# Altium schematic sheet Clock_Generator.SchDoc
size A1; SheetNumber: 2; SheetTotal: 3
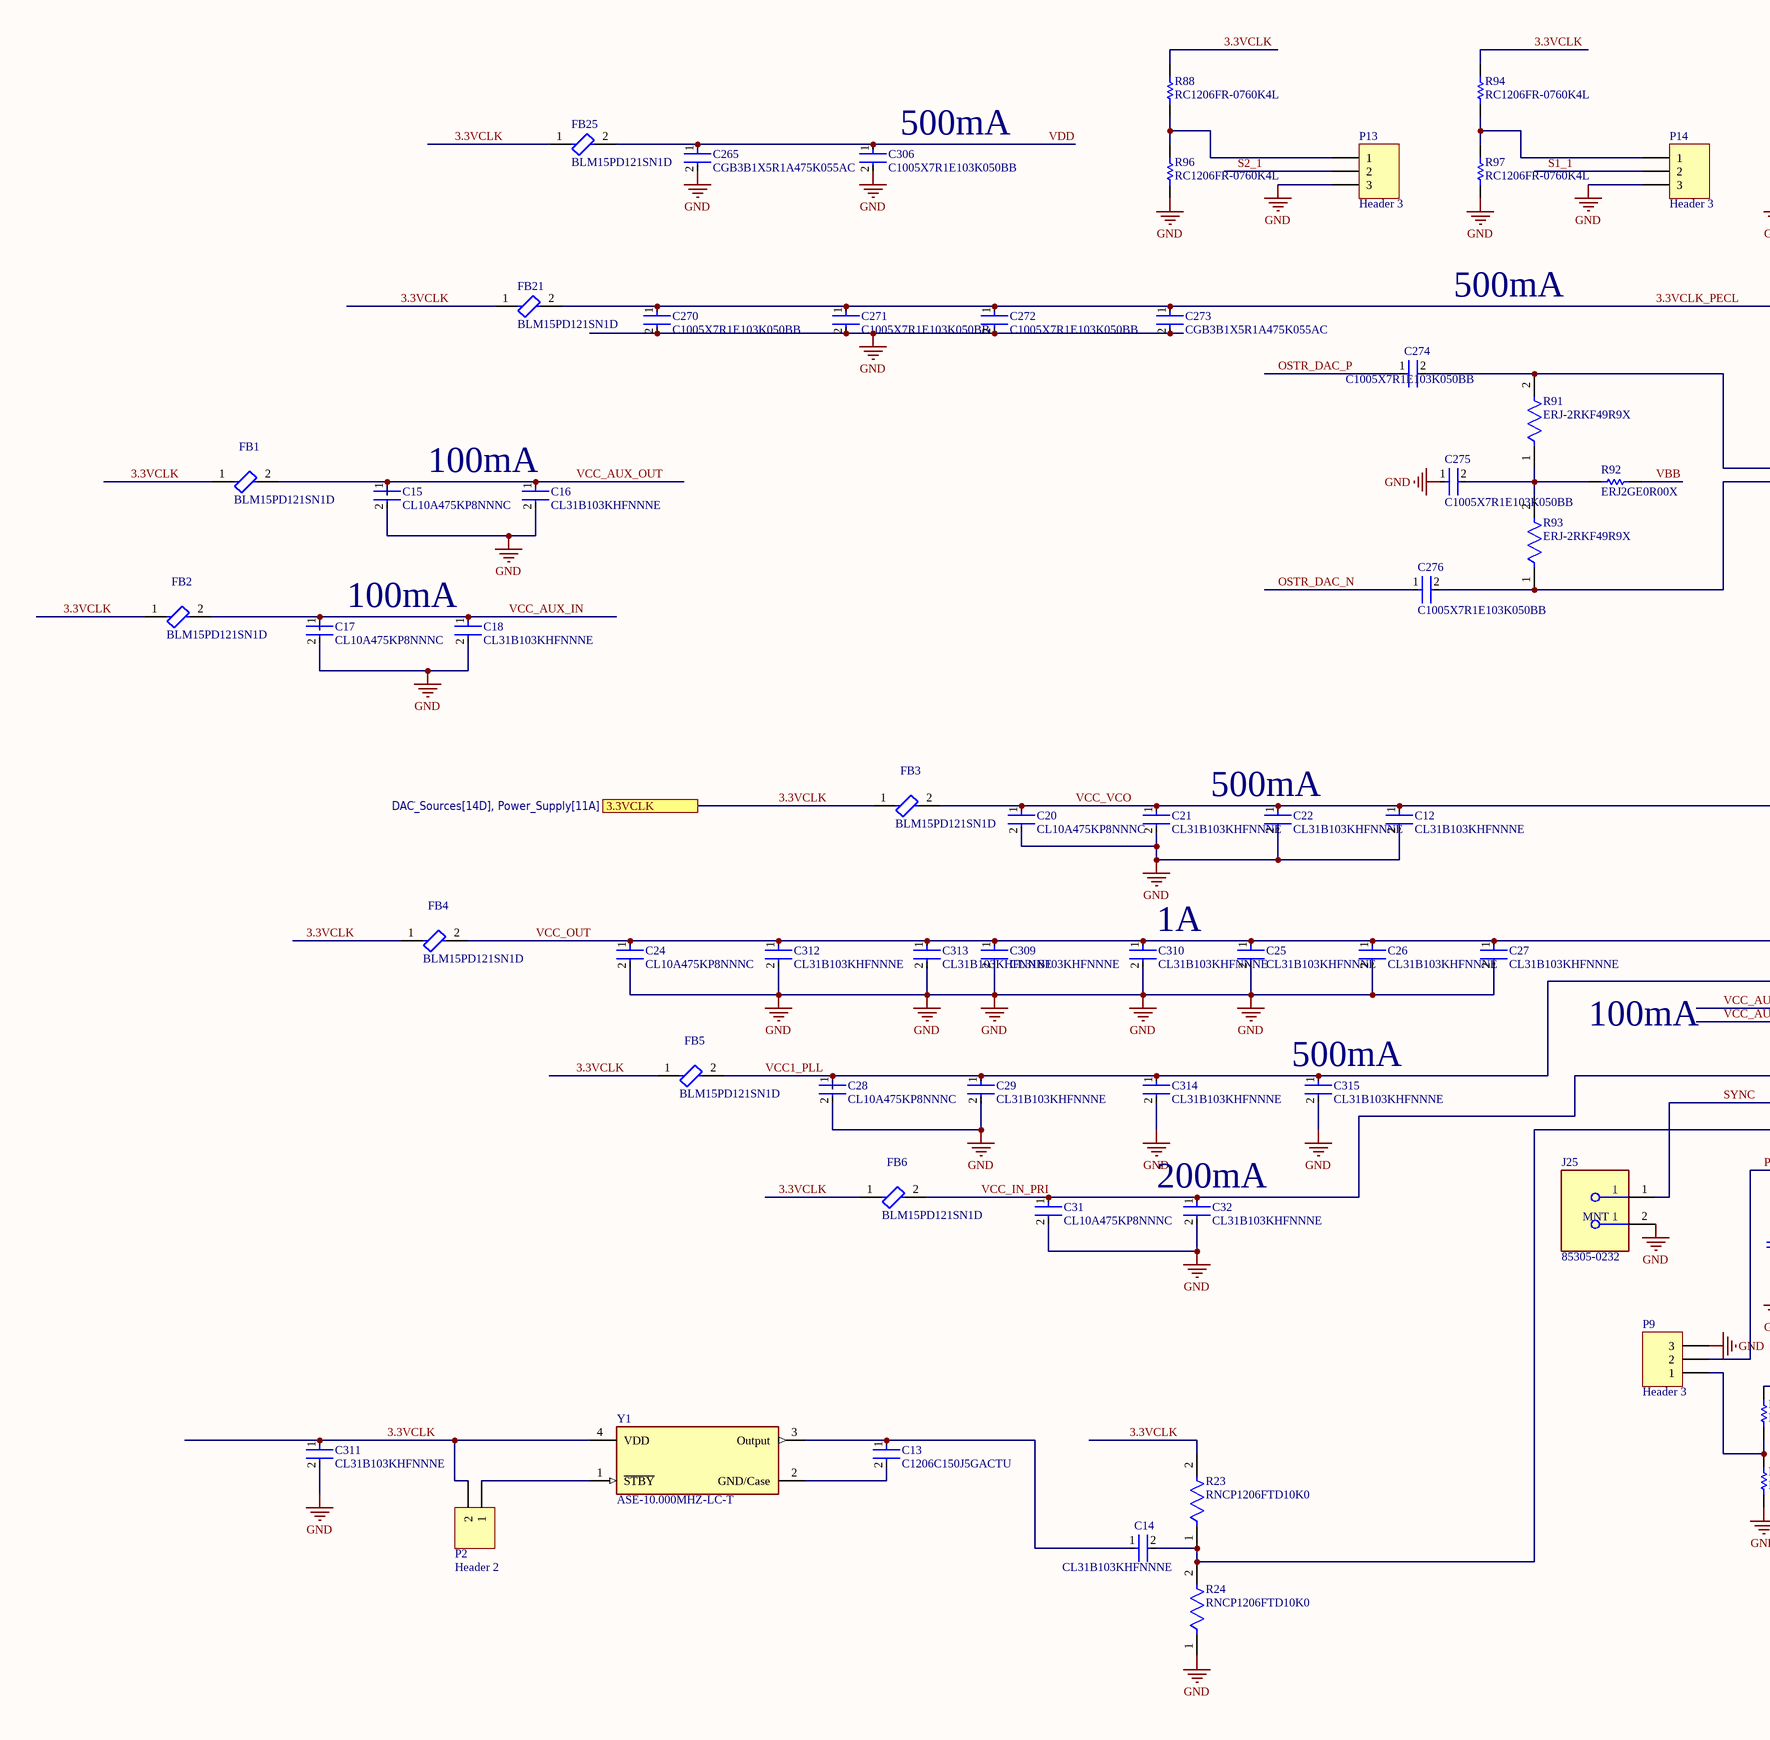
[diagram p0: Clock_Generator.SchDoc, left]
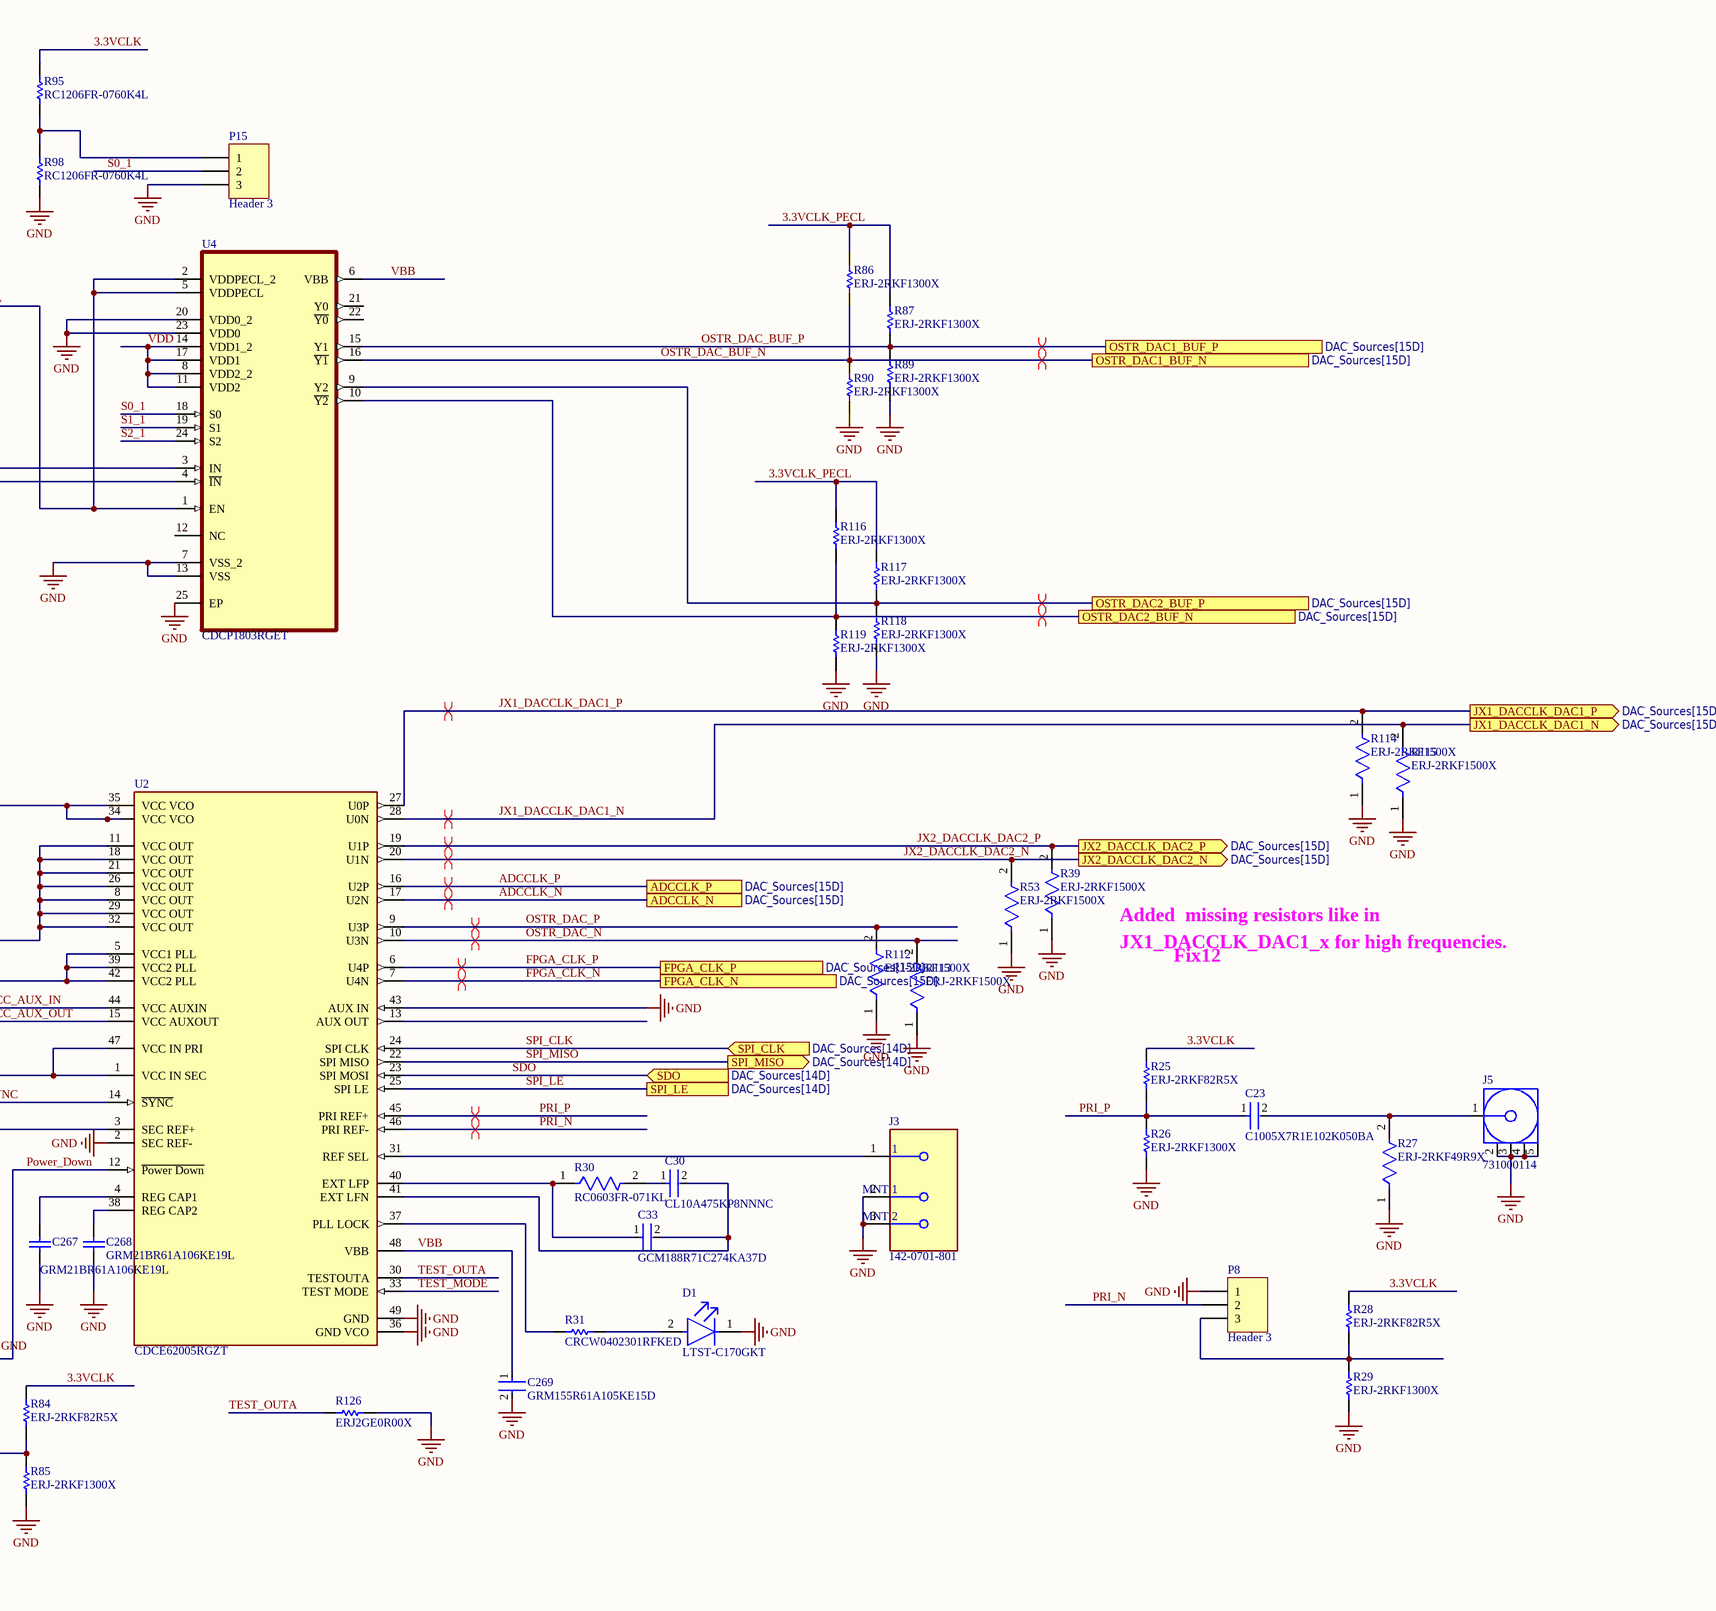
[diagram p1: Clock_Generator.SchDoc, right]

## Parts
C12  CL31B103KHFNNNE  [C1206]
C13  C1206C150J5GACTU  [C1206]
C14  CL31B103KHFNNNE  [C1206]
C15  CL10A475KP8NNNC  [C0603]
C16  CL31B103KHFNNNE  [C1206]
C17  CL10A475KP8NNNC  [C0603]
C18  CL31B103KHFNNNE  [C1206]
C20  CL10A475KP8NNNC  [C0603]
C21  CL31B103KHFNNNE  [C1206]
C22  CL31B103KHFNNNE  [C1206]
C23  C1005X7R1E102K050BA  [C0402]
C24  CL10A475KP8NNNC  [C0603]
C25  CL31B103KHFNNNE  [C1206]
C26  CL31B103KHFNNNE  [C1206]
C27  CL31B103KHFNNNE  [C1206]
C28  CL10A475KP8NNNC  [C0603]
C29  CL31B103KHFNNNE  [C1206]
C30  CL10A475KP8NNNC  [C0603]
C31  CL10A475KP8NNNC  [C0603]
C32  CL31B103KHFNNNE  [C1206]
C33  GCM188R71C274KA37D  [C0603]
C265  CGB3B1X5R1A475K055AC  [C0603]
C267  GRM21BR61A106KE19L  [C0805]
C268  GRM21BR61A106KE19L  [C0805]
C269  GRM155R61A105KE15D  [C0402]
C270  C1005X7R1E103K050BB  [C0402]
C271  C1005X7R1E103K050BB  [C0402]
C272  C1005X7R1E103K050BB  [C0402]
C273  CGB3B1X5R1A475K055AC  [C0603]
C274  C1005X7R1E103K050BB  [C0402]
C275  C1005X7R1E103K050BB  [C0402]
C276  C1005X7R1E103K050BB  [C0402]
C306  C1005X7R1E103K050BB  [C0402]
C309  CL31B103KHFNNNE  [C1206]
C310  CL31B103KHFNNNE  [C1206]
C311  CL31B103KHFNNNE  [C1206]
C312  CL31B103KHFNNNE  [C1206]
C313  CL31B103KHFNNNE  [C1206]
C314  CL31B103KHFNNNE  [C1206]
C315  CL31B103KHFNNNE  [C1206]
D1  LTST-C170GKT  [FP-LTST-C170GKT-MFG]
FB1  BLM15PD121SN1D  [BLM15]
FB2  BLM15PD121SN1D  [BLM15]
FB3  BLM15PD121SN1D  [BLM15]
FB4  BLM15PD121SN1D  [BLM15]
FB5  BLM15PD121SN1D  [BLM15]
FB6  BLM15PD121SN1D  [BLM15]
FB21  BLM15PD121SN1D  [BLM15]
FB25  BLM15PD121SN1D  [BLM15]
J3  142-0701-801  [FP-142-0701-801-MFG]
J5  731000114  [MOLX-731000114_V]
J25  85305-0232  [FP-85305-0232-MFG]
P2  Header 2  [HEADER_2X1]
P8  Header 3  [HEADER_3X1]
P9  Header 3  [HEADER_3X1]
P13  Header 3  [HEADER_3X1]
P14  Header 3  [HEADER_3X1]
P15  Header 3  [HEADER_3X1]
R23  RNCP1206FTD10K0  [R1206]
R24  RNCP1206FTD10K0  [R1206]
R25  ERJ-2RKF82R5X  [R0402]
R26  ERJ-2RKF1300X  [R0402]
R27  ERJ-2RKF49R9X  [R0402]
R28  ERJ-2RKF82R5X  [R0402]
R29  ERJ-2RKF1300X  [R0402]
R30  RC0603FR-071KL  [R0603]
R31  CRCW0402301RFKED  [R0402]
R39  ERJ-2RKF1500X  [R0402]
R53  ERJ-2RKF1500X  [R0402]
R84  ERJ-2RKF82R5X  [R0402]
R85  ERJ-2RKF1300X  [R0402]
R86  ERJ-2RKF1300X  [R0402]
R87  ERJ-2RKF1300X  [R0402]
R88  RC1206FR-0760K4L  [R1206]
R89  ERJ-2RKF1300X  [R0402]
R90  ERJ-2RKF1300X  [R0402]
R91  ERJ-2RKF49R9X  [R0402]
R92  ERJ2GE0R00X  [R0402]
R93  ERJ-2RKF49R9X  [R0402]
R94  RC1206FR-0760K4L  [R1206]
R95  RC1206FR-0760K4L  [R1206]
R96  RC1206FR-0760K4L  [R1206]
R97  RC1206FR-0760K4L  [R1206]
R98  RC1206FR-0760K4L  [R1206]
R112  ERJ-2RKF1500X  [R0402]
R113  ERJ-2RKF1500X  [R0402]
R114  ERJ-2RKF1500X  [R0402]
R115  ERJ-2RKF1500X  [R0402]
R116  ERJ-2RKF1300X  [R0402]
R117  ERJ-2RKF1300X  [R0402]
R118  ERJ-2RKF1300X  [R0402]
R119  ERJ-2RKF1300X  [R0402]
R126  ERJ2GE0R00X  [R0402]
U2  CDCE62005RGZT  [FP-RGZ0048D-IPC_A]
U4  CDCP1803RGET  [QFN25]
Y1  ASE-10.000MHZ-LC-T  [ASE]

## Ports
3.3VCLK (see DACֹֹ_Sources[14D], Power_Supply[11A]), ADCCLK_N (see DACֹֹ_Sources[15D]), ADCCLK_P (see DACֹֹ_Sources[15D]), FPGA_CLK_N (see DACֹֹ_Sources[15D]), FPGA_CLK_P (see DACֹֹ_Sources[15D]), JX1_DACCLK_DAC1_N (out, see DACֹֹ_Sources[15D]), JX1_DACCLK_DAC1_P (out, see DACֹֹ_Sources[15D]), JX2_DACCLK_DAC2_N (out, see DACֹֹ_Sources[15D]), JX2_DACCLK_DAC2_P (out, see DACֹֹ_Sources[15D]), OSTR_DAC1_BUF_N (see DACֹֹ_Sources[15D]), OSTR_DAC1_BUF_P (see DACֹֹ_Sources[15D]), OSTR_DAC2_BUF_N (see DACֹֹ_Sources[15D]), OSTR_DAC2_BUF_P (see DACֹֹ_Sources[15D]), SDO (in, see DACֹֹ_Sources[14D]), SPI_CLK (in, see DACֹֹ_Sources[14D]), SPI_LE (see DACֹֹ_Sources[14D]), SPI_MISO (out, see DACֹֹ_Sources[14D])

## Nets
GND: C12.2 C15.2 C16.2 C17.2 C18.2 C20.2 C21.2 C22.2 C24.2 C25.2 C26.2 C27.2 C28.2 C29.2 C31.2 C32.2 C265.2 C267.1 C268.1 C269.2 C270.2 C271.2 C272.2 C273.2 C275.1 C306.2 C309.2 C310.2 C311.2 C312.2 C313.2 C314.2 C315.2 D1.1(C) J3.2(MNT_1) J3.3(MNT_2) J5.2 J5.3 J5.4 J5.5 J25.2(MNT_1) P8.1 P9.3 P13.3 P14.3 P15.3 R24.1 R26.1 R27.1 R29.1 R39.1 R53.1 R85.1 R89.1 R90.1 R96.1 R97.1 R98.1 R112.1 R113.1 R114.1 R115.1 R118.1 R119.1 R126.2 U2.2(SEC_REF-) U2.36(GND_VCO) U2.43(AUX_IN) U2.49(GND) U4.7(VSS_2) U4.13(VSS) U4.20(VDD0_2) U4.23(VDD0) U4.25(EP)
3.3VCLK: C311.1 FB1.1 FB2.1 FB3.1 FB4.1 FB5.1 FB6.1 FB21.1 FB25.1 P2.2 R23.2 R25.2 R28.2 R84.2 R88.2 R94.2 R95.2 Y1.4(VDD) ; port 3.3VCLK
3.3VCLK_PECL: C270.1 C271.1 C272.1 C273.1 FB21.2 R86.2 R87.2 R116.2 R117.2 U4.1(EN) U4.2(VDDPECL_2) U4.5(VDDPECL)
ADCCLK_N: U2.17(U2N) ; port ADCCLK_N
ADCCLK_P: U2.16(U2P) ; port ADCCLK_P
FPGA_CLK_N: U2.7(U4N) ; port FPGA_CLK_N
FPGA_CLK_P: U2.6(U4P) ; port FPGA_CLK_P
JX1_DACCLK_DAC1_N: R115.2 U2.28(U0N) ; port JX1_DACCLK_DAC1_N
JX1_DACCLK_DAC1_P: R114.2 U2.27(U0P) ; port JX1_DACCLK_DAC1_P
JX2_DACCLK_DAC2_N: R53.2 U2.20(U1N) ; port JX2_DACCLK_DAC2_N
JX2_DACCLK_DAC2_P: R39.2 U2.19(U1P) ; port JX2_DACCLK_DAC2_P
OSTR_DAC2_BUF_N: R116.1 R119.2 U4.10(~{Y2}) ; port OSTR_DAC2_BUF_N
OSTR_DAC2_BUF_P: R117.1 R118.2 U4.9(Y2) ; port OSTR_DAC2_BUF_P
OSTR_DAC_BUF_N: R86.1 R90.2 U4.16(~{Y1}) ; port OSTR_DAC1_BUF_N
OSTR_DAC_BUF_P: R87.1 R89.2 U4.15(Y1) ; port OSTR_DAC1_BUF_P
OSTR_DAC_N: C276.1 R113.2 U2.10(U3N)
OSTR_DAC_P: C274.1 R112.2 U2.9(U3P)
Power_Down: P9.2 U2.12(~{Power_Down})
PRI_N: P8.2 U2.46(PRI_REF-)
PRI_P: C23.1 R25.1 R26.2 U2.45(PRI_REF+)
S0_1: P15.2 U4.18(S0)
S1_1: P14.2 U4.19(S1)
S2_1: P13.2 U4.24(S2)
SDO: U2.23(SPI_MOSI) ; port SDO
SPI_CLK: U2.24(SPI_CLK) ; port SPI_CLK
SPI_LE: U2.25(SPI_LE) ; port SPI_LE
SPI_MISO: U2.22(SPI_MISO) ; port SPI_MISO
SYNC: J25.1 U2.14(~{SYNC})
TEST_MODE: U2.33(TEST_MODE)
TEST_OUTA: R126.1 U2.30(TESTOUTA)
VBB: C269.1 R92.2 U2.48(VBB) U4.6(VBB)
VCC1_PLL: C28.1 C29.1 C314.1 C315.1 FB5.2 U2.5(VCC1_PLL) U2.39(VCC2_PLL) U2.42(VCC2_PLL)
VCC_AUX_IN: C17.1 C18.1 FB2.2 U2.44(VCC_AUXIN)
VCC_AUX_OUT: C15.1 C16.1 FB1.2 U2.15(VCC_AUXOUT)
VCC_IN_PRI: C31.1 C32.1 FB6.2 U2.1(VCC_IN_SEC) U2.47(VCC_IN_PRI)
VCC_OUT: C24.1 C25.1 C26.1 C27.1 C309.1 C310.1 C312.1 C313.1 FB4.2 U2.8(VCC_OUT) U2.11(VCC_OUT) U2.18(VCC_OUT) U2.21(VCC_OUT) U2.26(VCC_OUT) U2.29(VCC_OUT) U2.32(VCC_OUT)
VCC_VCO: C12.1 C20.1 C21.1 C22.1 FB3.2 U2.34(VCC_VCO) U2.35(VCC_VCO)
VDD: C265.1 C306.1 FB25.2 U4.8(VDD2_2) U4.11(VDD2) U4.14(VDD1_2) U4.17(VDD1)
NetC13_1: C13.1 C14.1 Y1.3(Output)
NetC13_2: C13.2 Y1.2(GND/Case)
NetC14_2: C14.2 R23.1 R24.2 U2.3(SEC_REF+)
NetC23_2: C23.2 J5.1 R27.2
NetC30_1: C30.1 R30.2
NetC30_2: C30.2 C33.2 U2.41(EXT_LFN)
NetC33_1: C33.1 R30.1 U2.40(EXT_LFP)
NetC267_2: C267.2 U2.4(REG_CAP1)
NetC268_2: C268.2 U2.38(REG_CAP2)
NetC274_2: C274.2 R91.2 U4.3(IN)
NetC275_2: C275.2 R91.1 R92.1 R93.2
NetC276_2: C276.2 R93.1 U4.4(~{IN})
NetD1_2: D1.2(A) R31.2
NetJ3_1: J3.1 U2.31(REF_SEL)
NetP2_1: P2.1 Y1.1(~{STBY})
NetP8_3: P8.3 R28.1 R29.2
NetP9_1: P9.1 R84.1 R85.2
NetP13_1: P13.1 R88.1 R96.2
NetP14_1: P14.1 R94.1 R97.2
NetP15_1: P15.1 R95.1 R98.2
NetR31_1: R31.1 U2.37(PLL_LOCK)

Not connected (* = marked no-connect by the designer): U2 13(AUX_OUT); U4 12(NC) 21(Y0) 22(~{Y0})

## Layout directives
differential pair: ADCCLK_N, ADCCLK_P, FPGA_CLK_N, FPGA_CLK_P, JX1_DACCLK_DAC1_N, JX1_DACCLK_DAC1_P, JX2_DACCLK_DAC2_N, JX2_DACCLK_DAC2_P, OSTR_DAC2_BUF_N, OSTR_DAC2_BUF_P, OSTR_DAC_BUF_N, OSTR_DAC_BUF_P, OSTR_DAC_N, OSTR_DAC_P, PRI_N, PRI_P

## Notes on the sheet
- (near C306) 500mA
- 500mA
- (near C16) 100mA
- 100mA
- (near C22) 500mA
- (near C310) 1A
- Added  missing resistors like in
- JX1_DACCLK_DAC1_x for high frequencies.
- Fix12
- (near C315) 500mA
- (near C32) 200mA

## Library data of the parts
C12 C14 C16 C18 C21 C22 C25-C27 C29 C32 C309-C315 = b4654b650e69147ec39a6b967a45e02: Cap Ceramic 10nF 630V X7R ±10% SMD 1206 +125°C Embossed T/R; Min Operating Temperature: -55°C; Max Operating Temperature: 125°C; Radiation Hardening: No; Case Code (Metric): 3216; Material: Ceramic; Dielectric: X7R; Length: 3.2mm; Thickness: 0.055inch; Capacitance: 10nF; Depth: 1.6mm; Width: 0.063inch; Lead Free: Lead Free; Case/Package: 1206; Case Code (Imperial): 1206; Voltage Rating (DC): 630V; Voltage Rating: 630V; Packaging: Tape and Reel; Tolerance: 10%; Voltage: 630V; Package Quantity: 1; Height: 1.25mm; Mount: Surface Mount
C13 = b4654b650e69147ec39a6b967a45e02: 1206 C 15pF Ceramic Multilayer Capacitor; 50 VDC; +125degC; C0G Dielec; +/-5%; Manufacturer: KEMET; Tolerance: 0.05; Temperature Coefficient: 15%; Automotive Grade: Grade 0; Voltage Rating: 50 V; Temperature Range High: +150°C; Temperature Characteristic: C0G; Device Class L1: Passive Components; Automotive: Yes; Device Class L2: Capacitors; Digikey Description: 1206 C 15pF Ceramic Multilayer Capacitor; 50 VDC; +125degC; C0G Dielec; +/-5%; Height: 0.88mm; RoHS: TRUE; Package: C1206C-EB; Value: 15 pF; Temperature Range Low: -55°C; Mouser Description: Multilayer Ceramic Capacitors MLCC - SMD/SMT 50volts 15pF C0G 5%; Lead Free: Yes; ComponentLink2Description: Datasheet; Ipc Land Pattern Name: CAPC320160X78; Octopart: https://octopart.com/c1206c150j5gactu-kemet-138585; Temperature: -55°C to +150°C; Material: Ceramic; Capacitance: 15 pF; ComponentLink2URL: https://content.kemet.com/datasheets/KEM_C1007_X8R_ULTRA_150C_SMD.pdf; Device Class L3: Ceramic Capacitors; Manufacturer Part Number: C1206C150J5GACTU; Category: Cap
C15 C17 C20 C24 C28 C30 C31 = b4654b650e69147ec39a6b967a45e02: Cap Ceramic 4.7uF 10V X5R ±10% Pad SMD 0603 +85°C T/R; Capacitance: 4.7uF; Case/Package: 0603; Packaging: Tape and Reel; Width: 0.031inch; Contact Plating: Tin; Thickness: 0.035inch; Package Quantity: 1; Voltage Rating: 10V; Case Code (Metric): 1608; Case Code (Imperial): 0603; Depth: 0.8mm; Height: 0.8mm; Tolerance: 10%; Max Operating Temperature: 85°C; Length: 1.6mm; Dielectric: X5R; Mount: Surface Mount; Radiation Hardening: No; Min Operating Temperature: -55°C
C23 = b4654b650e69147ec39a6b967a45e02: Multilayer Ceramic Capacitors 1nF ±10% 25V X7R SMD 0402; Insulation Resistance: 10GR; Dissipation Factor: 3%; Max Operating Temperature: 125°C; Thickness: 0.022inch; Height: 0.5mm; Mount: Surface Mount; RoHS Compliant: Yes; Dielectric Material: Ceramic; Tolerance: 10%; Length: 0.039inch; Number of Pins: 2; Series: C; Voltage Rating (DC): 25V; Termination: SMD/SMT; Voltage Rating: 25V; Capacitance: 1nF; Packaging: Tape and Reel; Resistor Type: Ceramic; Width: 0.02inch; Case Code (Imperial): 0402; REACH SVHC: No SVHC; Dielectric: X7R; Min Operating Temperature: -55°C; Case Code (Metric): 1005; Lead Free: Lead Free; Case/Package: 0402; Weight: 2.3E-05oz; Depth: 0.5mm; Package Quantity: 1
C33 = 02cd4be3c70576c341d710602a673aa: Ceramic Capacitor for Automotive 270nF  ±10% 16VDC X7R 0603 Paper T/R; Voltage Rating (DC): 16V; Dielectric: X7R; Case/Package: 0603; Capacitance: 270nF; Tolerance: 10%
C265 C273 = b4654b650e69147ec39a6b967a45e02: CAP CER 4.7UF 10V X5R 0603; Tolerance: 10%; Mount: Surface Mount; Weight: 7.1E-05oz; Case Code (Metric): 1608; Thickness: 0.022inch; Voltage Rating: 10V; Termination: SMD/SMT; Min Operating Temperature: -55°C; Package Quantity: 1; Case/Package: 0603; Capacitance: 4.7uF; RoHS Compliant: Yes; Packaging: Tape and Reel; Max Operating Temperature: 85°C; Width: 0.031inch; Series: CGB; Height: 0.55mm; Dielectric: X5R; Depth: 0.8mm; Case Code (Imperial): 0603; Length: 1.6mm; Lead Free: Lead Free; Voltage Rating (DC): 10V
C267 C268 = CAP-NP-2: CAP, Ceramic, 10 uF, 10%, 10 V, 0805, RoHS, Tape and Reel; Manufacturer: Murata; Voltage - Rated: 10V; Product Training Modules: High-CapMultilayerCeramicCapacitors; Catalog Drawings: GRMSeries_0805_1.25; Temperature Coefficient: X5R; Online Catalog: GRMSeries; Featured Product: GA3SafetyRecognizedCapsandHi-CapMLCC; Capacitance: 10µF; Other Names: 490-1709-6; Applications: GeneralPurpose; Category: Capacitors; Datasheet Version: Aug-14; Datasheet URL: https://datasheet.ciiva.com/3777/210grm21br61a106ke1923-3777175.pdf; Ratings: -; Height - Seated (Max): -; Lead Spacing: -; Operating Temperature: -55degC~85degC; Features: -; Package Description: 2-Pin Surface Mount Device (0805), Body 2.1 x 1.35 mm; Standard Package: 1; Mounting Type: SurfaceMount,MLCC; Package Reference: 805; Tolerance: ±10%; Manufacturer URL: http://www.murata.com/; Size / Dimension: 0.079"Lx0.049"W(2.00mmx1.25mm); Packaging: Digi-Reel; Thickness (Max): 0.053"(1.35mm); Package / Case: 0805(2012Metric); Family: CeramicCapacitors; Series: GRM; Lead Style: -
C269 = 02cd4be3c70576c341d710602a673aa: CAP CER 1UF 10V X5R 0402; Manufacturer: Murata; Material: Ceramic; Tolerance: 10%; Temperature Coefficient: 15%; Octopart: https://octopart.com/grm155r61a105ke15d-murata-197442; Manufacturer Part Number: GRM155R61A105KE15D; Lead Free: Yes; ComponentLink2Description: Datasheet; Temperature: -55°C to +85°C; Temperature Range High: +85°C; Height: 0.55mm; Capacitance: 1uF; Ipc Land Pattern Name: CAPC10050X50; ComponentLink2URL: https://search.murata.co.jp/Ceramy/image/img/A01X/G101/ENG/GRM155R61A105KE15-01A.pdf; Temperature Range Low: -55°C; Device Class L2: Capacitors; Voltage Rating: 10V; RoHS: TRUE; Device Class L1: Passive Components; Device Class L3: Ceramic Capacitors; Temperature Characteristic: X5R; Mouser Description: 0402 1 uF 10 V ±10% Tolerance X5R Surface Mount Multilayer Ceramic Capacitor; Automotive: No; Package: GRM15-0.1; Digikey Description: CAP CER 1UF 10V X5R 0402; Value: 1uF; Category: Cap
C270-C272 C274-C276 C306 = b4654b650e69147ec39a6b967a45e02: Multilayer Ceramic Capacitors 10nF ±10% 25V X7R SMD 0402; Dielectric Material: Ceramic; Case/Package: 0402; RoHS Compliant: Yes; REACH SVHC: No SVHC; Max Operating Temperature: 125°C; Package Quantity: 1; Capacitance: 10nF; Min Operating Temperature: -55°C; Width: 0.02inch; Radiation Hardening: No; Tolerance: 10%; Mount: Surface Mount; Series: C; Dielectric: X7R; Length: 1mm; Thickness: 0.022inch; Case Code (Imperial): 0402; Case Code (Metric): 1005; Resistor Type: Ceramic; Lead Free: Lead Free; Voltage: 25V; Packaging: Tape and Reel; Weight: 2.3E-05oz; Height: 0.5mm; Number of Pins: 2; Depth: 0.5mm; Voltage Rating (DC): 25V; Termination: SMD/SMT; Voltage Rating: 25V
D1 = 8706943c75ba83719d021d2fdc84c58: LED GREEN CLEAR SMD; Dominant Wavelength: 569nm; Lens Style: Diffused; Forward Voltage: 2.1V; Number of Elements: 1; Wavelength: 565nm; Luminous Intensity: 6mcd; Test Current: 10mA; Power Dissipation: 100mW; Reverse Voltage: 5V; Forward Current: 30mA; Viewing Angle: 130°; Lens Color: Colorless; Min Operating Temperature: -55°C; Number of Pins: 2; Max Operating Temperature: 85°C; Color: Green; Radiation Hardening: No; Illumination Color: Green; Case Code (Metric): 2012; Lens Transparency: Clear; Case/Package: 0805; Width: 1.25mm; Case Code (Imperial): 0805; Package Quantity: 1; Height: 1.1mm; Depth: 1.25mm; Length: 2mm; Power Rating: 100mW; Lead Free: Lead Free; Number of LEDs: 1; Packaging: Tape and Reel; Mount: Surface Mount; Voltage: 5V
FB1-FB6 FB21 FB25 = 5f30dd21d616792df468990f7003faa: Chip Ferrite Bead, 0402, 120Ω @ 100MHz, 0.09Ω, 25%, 1.3A; Impedance: 120R; Material: Steel; Number of Lines: 1; DC Resistance (DCR): 90mR; Number of Pins: 2; Military Standard: Not; Width: 0.5mm; Depth: 0.55mm; Lead Free: Lead Free; Test Frequency: 100MHz; Case Code (Metric): 1005; Case Code (Imperial): 0402; Current Rating: 1.3A; Package Quantity: 1; Height: 0.5mm; Radiation Hardening: No; Tolerance: 25%; Max DC Current: 1.3A; Packaging: Tape and Reel; REACH SVHC: No SVHC; Case/Package: 0402; Min Operating Temperature: -55°C; Max Current Rating: 1.3A; Length: 1mm; Number of Circuits: 1; Core Material: Ferrite; Max Operating Temperature: 125°C; Termination: SMD/SMT; DC Current: 1.3A
J3 = 89929399afe843c8b6880c6cbd0f99a: CONN SMA JACK STR 50OHM EDGE MNT; Frequency: 18GHz; Operating Frequency: 0 to 18 GHz; Body Material: Brass; Impedance: 50R; Voltage Rating: 335V; Gender: Female; Body Plating: Gold; Orientation: Straight; Length: 0.44inch; Max Operating Temperature: 165°C; Package Quantity: 5; Packaging: Bulk; Series: SMA; Contact Material: Copper; Min Operating Temperature: -65°C; Depth: 25.58mm; RoHS Compliant: Yes; Case/Package: SMA; Max Frequency: 18GHz; Radiation Hardening: No; Contact Plating: Gold; Mount: Edge; Connector Type: SMA; Fastening Type: Threaded; Termination: Solder
J5 = CN-S-4F-RF5: SMA Right-Angle PCB Jack Receptacle, Brass Body, Gold Plated, 50 Ohm, 5-Pin THD, RoHS, Tray; Manufacturer: Molex; Datasheet Version: 09/2016; Package Description: 5-Pin Through Hole Device, Body 14.8 x 6.35 mm, Pitch 2.54 mm; Datasheet URL: http://www.molex.com/webdocs/datasheets/pdf/en-us/0731000114_RF_COAX_CONNECTORS.pdf; Manufacturer URL: http://www.molex.com/; Package Reference: 731000114; Mounting Technology: ThroughHole; Package URL: http://www.molex.com/pdm_docs/sd/731000114_sd.pdf
J25 = d2a53f3a980517e545f22a6fb6569cc: CONN SMP PLUG STR 50 OHM SMD; Plating: Gold; Max Frequency: 40GHz; Dielectric Material: Polymer; Impedance: 50R; Body Material: Brass; Packaging: Tape and Reel; Mount: Surface Mount; Contact Plating: Gold; Package Quantity: 1; Orientation: Straight; Center Contact Plating: Gold; Body Plating: Gold; Connector Type: Plug; Series: 85305; Min Operating Temperature: -65°C; Max Operating Temperature: 155°C; Contact Material: Brass; Termination: Solder; Depth: 5.2mm; Housing Color: Gold; RoHS Compliant: Yes; Length: 5mm; Radiation Hardening: No; Fastening Type: Pull
P2 = Header 2: Header, 2-Pin; LatestRevisionDate: 17-Jul-2002; LatestRevisionNote: Re-released for DXP Platform.; Publisher: Altium Limited
P8 P9 P13-P15 = Header 3: Header, 3-Pin; LatestRevisionDate: 17-Jul-2002; LatestRevisionNote: Re-released for DXP Platform.; Publisher: Altium Limited
R23 R24 = 1029c3af85768c4190bb7ad29bc67b5: 10kΩ ±1% 0.5W 1206 High Power Anti-Sulfur Thin Film Chip Resistor; Max Power Dissipation: 500mW; Temperature Coefficient: 100ppm/°C; Resistance: 10kR; Resistor Type: Thin Film; Series: RNCP; Case Code (Imperial): 1206; Min Operating Temperature: -55°C; Length: 0.122inch; Case Code (Metric): 3216; Mount: Surface Mount; Max Operating Temperature: 155°C; Height: 0.024inch; Width: 0.059inch; Case/Package: 1206; Number of Terminations: 2; Tolerance: 1%; Features: Moisture Resistant; Packaging: Tape and Reel; RoHS Compliant: Yes
R25 R26 R28 R29 R84-R87 R89 R90 R116-R119 = RES: Manufacturer: Panasonic
  R25 R28 R84: Part Number: ERJ-2RKF82R5X
  R26 R29 R85-R87 R89 R90 R116-R119: Part Number: ERJ-2RKF1300X
R27 R91 R93 = 8db39607336c341a927600551d01821: RES SMD 49.9 OHM 1% 1/10W 0402; Voltage Rating (DC): 50V; Temperature Coefficient: 100ppm/°C; Power Rating: 100mW; Resistance: 49.9R; Resistance Tolerance: 1%; Height: 0.35mm; Lead Free: Lead Free; Construction: Rectangular; Termination: SMD/SMT; Radiation Hardening: No; Military Standard: Not; Max Operating Temperature: 155°C; Packaging: Tape and Reel; Tolerance: 1%; Voltage Rating: 50V; Series: ERJ; Features: Automotive AEC-Q200; Mount: Surface Mount; Case/Package: 0402; Max Power Dissipation: 100mW; Case Code (Metric): 1005; Depth: 0.5mm; Width: 0.02inch; Technology: THICK FILM; Min Operating Temperature: -55°C; Length: 1mm; Resistor Type: Thick Film; Number of Terminations: 2; Contact Plating: Tin; Case Code (Imperial): 0402; RoHS Compliant: Yes; Working Voltage: 50V; Package Quantity: 1
R30 = 1029c3af85768c4190bb7ad29bc67b5: RES 1K OHM 1% 1/10W 0603; Resistance: 1kR; Voltage Rating: 50V; Power Rating: 100mW; Temperature Coefficient: 100ppm/°C; Military Standard: Not; REACH SVHC: No SVHC; Size Code: 0603; Features: Moisture Resistant; Number of Terminations: 2; Technology: THICK FILM; Series: RC; Case Code (Metric): 1608; Resistance Tolerance: 1%; Resistor Type: Thick Film; Termination: SMD/SMT; Contact Plating: Tin; Radiation Hardening: No; Min Operating Temperature: -55°C; Max Operating Temperature: 155°C; Packaging: Tape and Reel; Max Power Dissipation: 100mW; RoHS Compliant: Yes; Height: 0.45mm; Lead Free: Lead Free; Case/Package: 0603; Length: 1.6mm; Tolerance: 1%; Case Code (Imperial): 0603; Construction: Rectangular; Depth: 0.8mm
R31 = RES: Manufacturer: Vishay Dale; Part Number: CRCW0402301RFKED
R39 R53 R114 R115 = 1029c3af85768c4190bb7ad29bc67b5: RES SMD 150 OHM 1% 1/10W 0402; Resistance: 150R; Voltage Rating: 50V; Power Rating: 100mW; Temperature Coefficient: 100ppm/°C; Mount: Surface Mount; Tolerance: 1%; Height: 0.35mm; Resistance Tolerance: 1%; Package Quantity: 1; REACH SVHC: No SVHC; Number of Terminations: 2; Number of Pins: 2; Length: 1mm; Size Code: 0402; Min Operating Temperature: -55°C; Features: Automotive AEC-Q200; Contact Plating: Tin; Voltage Rating (DC): 50V; Series: ERJ; Depth: 0.5mm; Case Code (Metric): 1005; Case/Package: 0402; Construction: Rectangular; RoHS Compliant: Yes; Case Code (Imperial): 0402; Packaging: Tape and Reel; Max Operating Temperature: 155°C; Termination: SMD/SMT; Radiation Hardening: No; Lead Free: Lead Free; Military Standard: Not; Technology: THICK FILM; Width: 0.02inch; Max Power Dissipation: 100mW; Resistor Type: Thick Film
R88 R94-R98 = RES: Manufacturer: Yageo; Part Number: RC1206FR-0760K4L
R92 R126 = RES-2: Chip Resistor, 0 Ohm, 0.1 W, -55 to 155 degC, 0402 (1005 Metric), RoHS, Tape and Reel; Manufacturer: Panasonic; Voltage Rating (DC): 50V; Temperature Coefficient: 600ppm/��C; Max Power Dissipation: 100mW; Resistance: 0mOhm; Tolerance: 5%; Number of Terminations: 2; Mount: SurfaceMount; Height: 0.35mm; Packaging: TapeandReel; Contact Plating: Tin; Manufacturer URL: http://www.panasonic.com/; Composition: ThickFilm; Max Operating Temperature: 155degC; REACH SVHC: NoSVHC; Case/Package: 0402; Package Reference: 402; Depth: 0.5mm; Package Description: 2-Pin Surface Mount Device, Body 1 x 0.5 mm; Datasheet URL: https://industrial.panasonic.com/cdbs/www-data/pdf/RDA0000/AOA0000C301.pdf; RoHSCompliant: True; Case Code (Imperial): 0402; Military Standard: Not; Min Operating Temperature: -55degC; Power Rating: 100mW; Datasheet Version: 03/2015; Length: 1mm; Case Code (Metric): 1005; Termination: SMD/SMT; Mounting Technology: SurfaceMount; Voltage Rating: 50V; Width: 0.02inch; Package Quantity: 1; Lead Free: LeadFree; Radiation Hardening: No
R112 R113 = CMP-1011-00415-3: RES SMD 150 OHM 1% 1/10W 0402; Resistance: 150R; Voltage Rating: 50V; Power Rating: 100mW; Temperature Coefficient: 100ppm/°C; Mount: Surface Mount; Tolerance: 1%; Height: 0.35mm; Resistance Tolerance: 1%; Package Quantity: 1; REACH SVHC: No SVHC; Number of Terminations: 2; Number of Pins: 2; Length: 1mm; Size Code: 0402; Min Operating Temperature: -55°C; Features: Automotive AEC-Q200; Contact Plating: Tin; Voltage Rating (DC): 50V; Series: ERJ; Depth: 0.5mm; Case Code (Metric): 1005; Case/Package: 0402; Construction: Rectangular; RoHS Compliant: Yes; Case Code (Imperial): 0402; Packaging: Tape and Reel; Max Operating Temperature: 155°C; Termination: SMD/SMT; Radiation Hardening: No; Lead Free: Lead Free; Military Standard: Not; Technology: THICK FILM; Width: 0.02inch; Max Power Dissipation: 100mW; Resistor Type: Thick Film
U2 = 79e6de338fe35b6fdc3d186d6aa1691: IC CLK SYNTH/JITTER CLEANR 48QFN; Frequency: 1.175GHz; Input: Crystal; Nominal Supply Current: 20mA; Min Supply Voltage: 3V; Operating Supply Voltage: 3.3V; PLL: Yes; Max Power Dissipation: 1.7W; Max Frequency: 1.5GHz; Max Supply Voltage: 3.6V; Number of Outputs: 5; Number of Circuits: 1; Interface: SPI; Radiation Hardening: No; Lead Free: Lead Free; RoHS Compliant: Yes; REACH SVHC: No SVHC; Weight: 0.004868oz; Number of Pins: 48; Termination: SMD/SMT; Length: 6.85mm; Series: CDCE62005; Height: 0.8mm; Case/Package: VQFN; Width: 6.85mm; Packaging: Tape and Reel; Max Operating Temperature: 85°C; Mount: Surface Mount; Contact Plating: Gold; Package Quantity: 1; Supply Current: 20mA; Min Operating Temperature: -40°C; Input Current: 20mA
U4 = CDCP1803RGET: 1:3 LVPECL clock buffer with programable divider; MF: Texas Instruments; SnapEDA_Link: https://www.snapeda.com/parts/CDCP1803RGET/Texas+Instruments/view-part/?ref=snap; Package: QFN-24 Texas Instruments; Value: *; MP: CDCP1803RGET; Check_prices: https://www.snapeda.com/parts/CDCP1803RGET/Texas+Instruments/view-part/?ref=eda
Y1 = 61a724e6190563596ac712fef61ad37: XTAL Oscillator 10MHz ±50ppm CMOS 3.3V 4-SMD 3.2mm x 2.5mm; Max Supply Voltage: 3.465V; Max Supply Current: 7mA; Load Capacitance: 15pF; Min Supply Voltage: 3.135V; Number of Pins: 4; Case/Package: SMD/SMT; Lead Free: Lead Free; Depth: 2.5mm; Radiation Hardening: No; Width: 0.098inch; Length: 3.2mm; Termination: SMD/SMT; Min Operating Temperature: -40°C; Operating Supply Voltage: 3.3V; Series: ASE; Packaging: Tape and Reel; REACH SVHC: No SVHC; Mount: Surface Mount; Frequency: 10MHz; Package Quantity: 1000; Max Operating Temperature: 85°C; Operating Frequency: 10 MHz; Height: 0.047inch; Frequency Stability: 50ppm